# EAGLE design tvbgone3 (EAGLE 5.01)
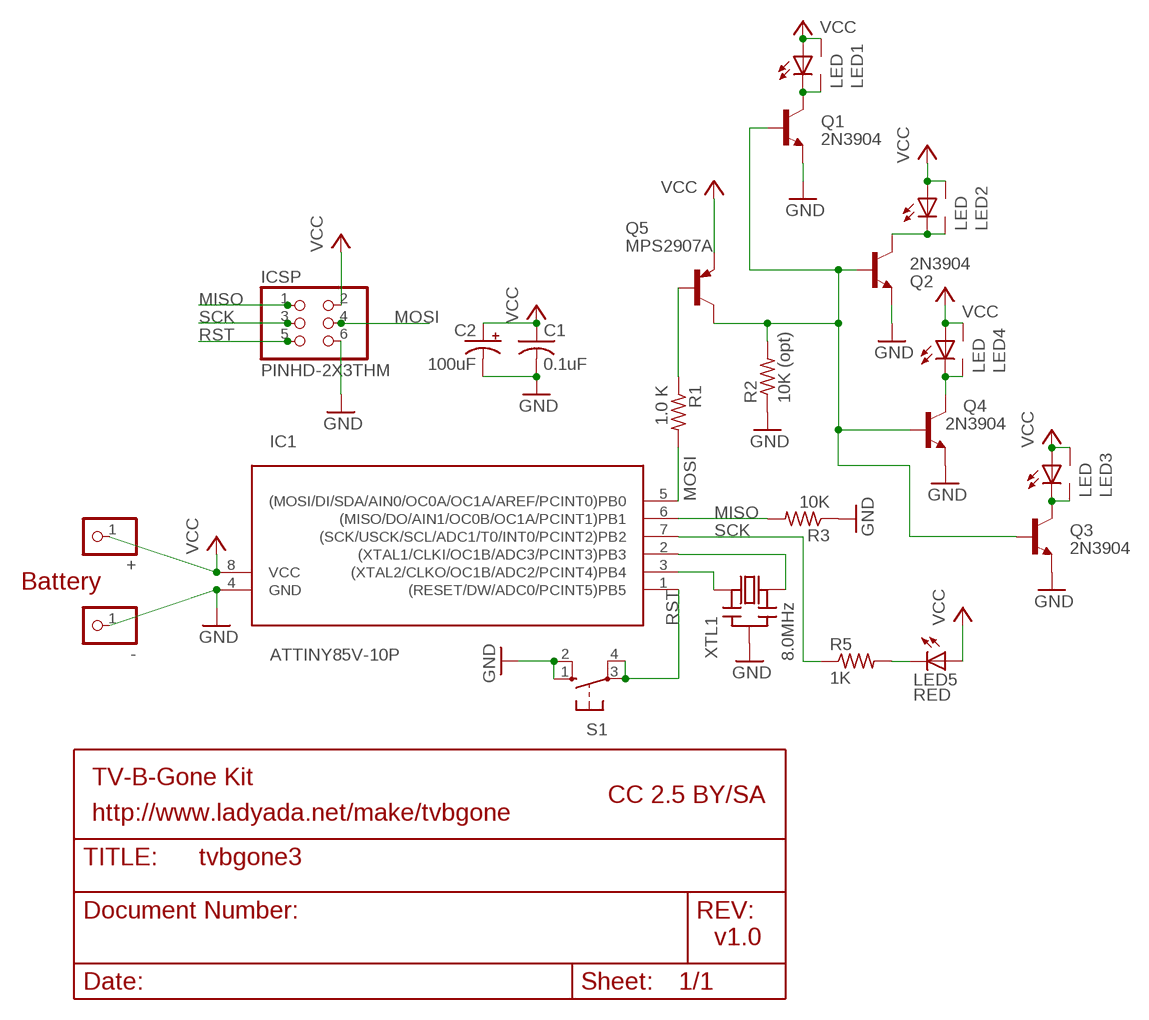
[diagram p0: schematic, sheet 1]

## Parts
+  PINHD-1X1  [1X01]
-  PINHD-1X1  [1X01]
C1  0.1uF  C-US025-025X050  [C025-025X050]
C2  100uF  CPOL-USE2.5-5  [E2,5-5]
IC1  ATTINY85V-10P  [DIL08]
ICSP  PINHD-2X3THM  [ISP6]
LED1  LED  [5MM-SIDE]
LED2  LED  [5MM-SIDE]
LED3  LED  [5MM-SIDE]
LED4  LED  [5MM-SIDE]
LED5  RED  LED3MM  [LED3MM]
Q1  2N3904  2N3904EZ  [TO92-EZ]
Q2  2N3904  2N3904EZ  [TO92-EZ]
Q3  2N3904  2N3904EZ  [TO92-EZ]
Q4  2N3904  2N3904EZ  [TO92-EZ]
Q5  MPS2907A  [TO92-CBE]
R1  1.0 K  R-US_0207/10  [0207/10]
R2  10K (opt)  R-US_0207/10  [0207/10]
R3  10K  R-US_0207/10  [0207/10]
R5  1K  R-US_0207/10  [0207/10]
S1  10-XX  [B3F-10XX]
XTL1  8.0MHz  CERMOSCILL  [CERM_OSC]

## Nets
GND: -.1 C1.2 C2.- IC1.4(GND) ICSP.6 Q1.3(E) Q2.3(E) Q3.3(E) Q4.3(E) R2.1 R3.1 S1.1(S) S1.2(S1) XTL1.P$2(GND)
MISO: IC1.6((MISO/DO/AIN1/OC0B/OC1A/PCINT1)PB1) ICSP.1 R3.2
MOSI: IC1.5((MOSI/DI/SDA/AIN0/OC0A/OC1A/AREF/PCINT0)PB0) ICSP.4 R1.2
N$1: IC1.3((XTAL2/CLKO/OC1B/ADC2/PCINT4)PB4) XTL1.P$1(IN)
N$2: IC1.2((XTAL1/CLKI/OC1B/ADC3/PCINT3)PB3) XTL1.P$3(OUT)
N$3: LED5.K(C) R5.2
N$6: Q5.B R1.1
N$7: LED4.K2(C1) LED4.K(C) Q4.1(C)
N$8: LED2.K2(C1) LED2.K(C) Q2.1(C)
N$9: LED3.K2(C1) LED3.K(C) Q3.1(C)
N$10: Q1.2(B) Q2.2(B) Q3.2(B) Q4.2(B) Q5.C R2.2
N$11: LED1.K2(C1) LED1.K(C) Q1.1(C)
RST: IC1.1((RESET/DW/ADC0/PCINT5)PB5) ICSP.5 S1.3(P) S1.4(P1)
SCK: IC1.7((SCK/USCK/SCL/ADC1/T0/INT0/PCINT2)PB2) ICSP.3 R5.1
VCC: +.1 C1.1 C2.+ IC1.8(VCC) ICSP.2 LED1.A LED1.A2(A1) LED2.A LED2.A2(A1) LED3.A LED3.A2(A1) LED4.A LED4.A2(A1) LED5.A Q5.E

## Notes on the sheet
- Battery
- TV-B-Gone Kit
- CC 2.5 BY/SA
- http://www.ladyada.net/make/tvbgone
- v1.0

## Library data of the parts
+ - = ybox2:PINHD-1X1: PIN HEADER
C1 = rcl-ez:C-US: CAPACITOR, American symbol
C2 = rcl-ez:CPOL-US: POLARIZED CAPACITOR, American symbol
IC1 = avr:ATTINY85: MICROCONTROLLER 8 Kbytes FLASH 512 bytes EEPROM 512 bytes RAM 4-channel 10 bit ADC USI
ICSP = adaprog:PINHD-2X3
LED1-LED4 = tvbgone:LED
LED5 = minimidi:LED: LED OSRAM: - CHIPLED LG R971, LG N971, LY N971, LG Q971, LY Q971, LO R971, LY R971 LH N974, LH R974 LS Q976, LO Q976, LY Q976 LO Q996 - Hyper CHIPLED LW Q18S LB Q993, LB Q99A, LB R99A - SideLED LS A670, LO A670, LY A670, LG A670, LP A670 LB A673, LV A673, LT A673, LW A673 LH A674 LY A675 LS A676, LA A676, LO A676, LY A676, LW A676 LS A679, LY A679, LG A679 - Hyper Micro SIDELED® LS Y876, LA Y876, LO Y876, LY Y876 LT Y87S - SmartLED LW L88C, LW L88S LB L89C, LB L89S, LG L890 LS L89K, LO L89K, LY L89K LS L896, LA L896, LO L896, LY L896 - TOPLED LS T670, LO T670, LY T670, LG T670, LP T670 LSG T670, LSP T670, LSY T670, LOP T670, LYG T670 LG T671, LOG T671, LSG T671 LB T673, LV T673, LT T673, LW T673 LH T674 LS T676, LA T676, LO T676, LY T676, LB T676, LH T676, LSB T676, LW T676 LB T67C, LV T67C, LT T67C, LS T67K, LO T67K, LY T67K, LW E67C LS E67B, LA E67B, LO E67B, LY E67B, LB E67C, LV E67C, LT E67C LW T67C LS T679, LY T679, LG T679 LS T770, LO T770, LY T770, LG T770, LP T770 LB T773, LV T773, LT T773, LW T773 LH T774 LS E675, LA E675, LY E675, LS T675 LS T776, LA T776, LO T776, LY T776, LB T776 LHGB T686 LT T68C, LB T68C - Hyper Mini TOPLED® LB M676 - Mini TOPLED Santana® LG M470 LS M47K, LO M47K, LY M47K Source: http://www.osram.convergy.de/
Q1-Q4 = transistor-npn:2N3904: NPN Transistor
Q5 = transistor-pnp:MPS2907*: PNP Transistror
R1-R3 R5 = rcl-ez:R-US_: RESISTOR, American symbol
S1 = switch-omron:10-XX: OMRON SWITCH
XTL1 = digg:CERMOSCILL

## Board
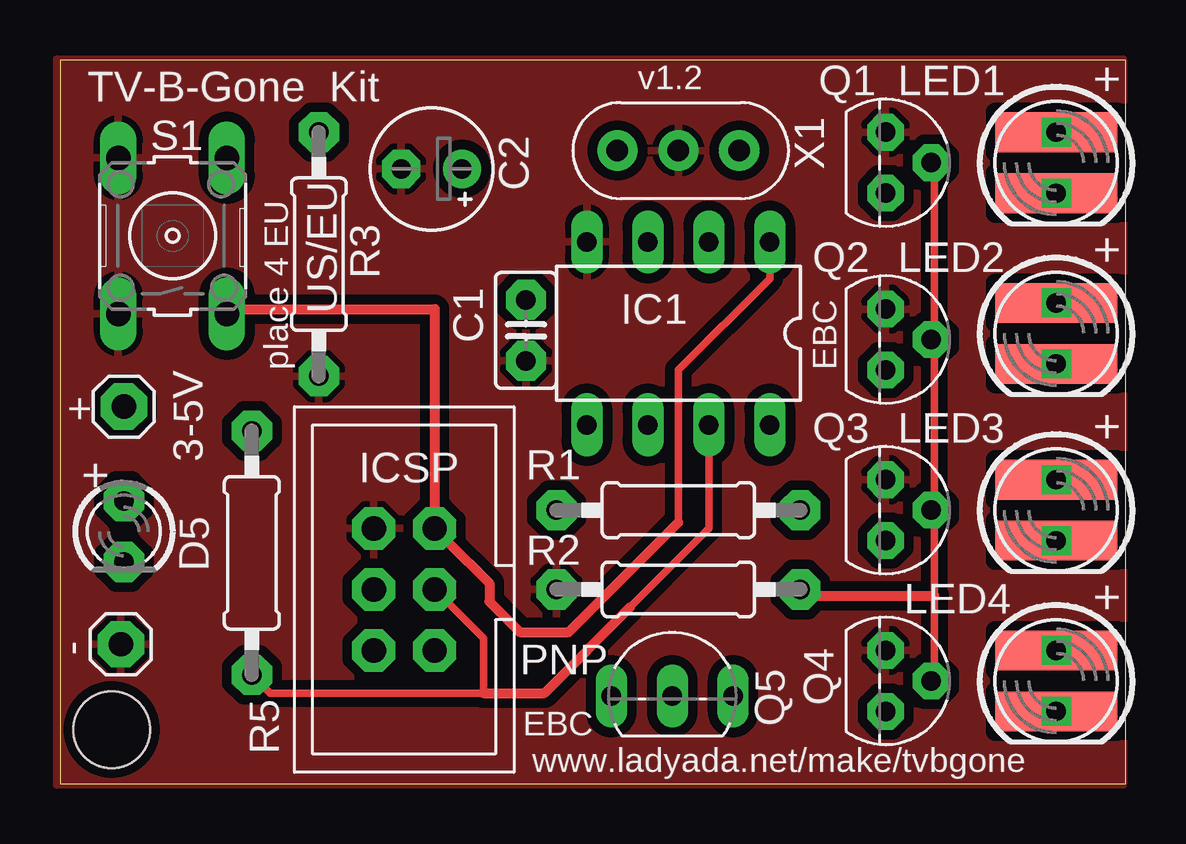
[diagram p1: board, top side]
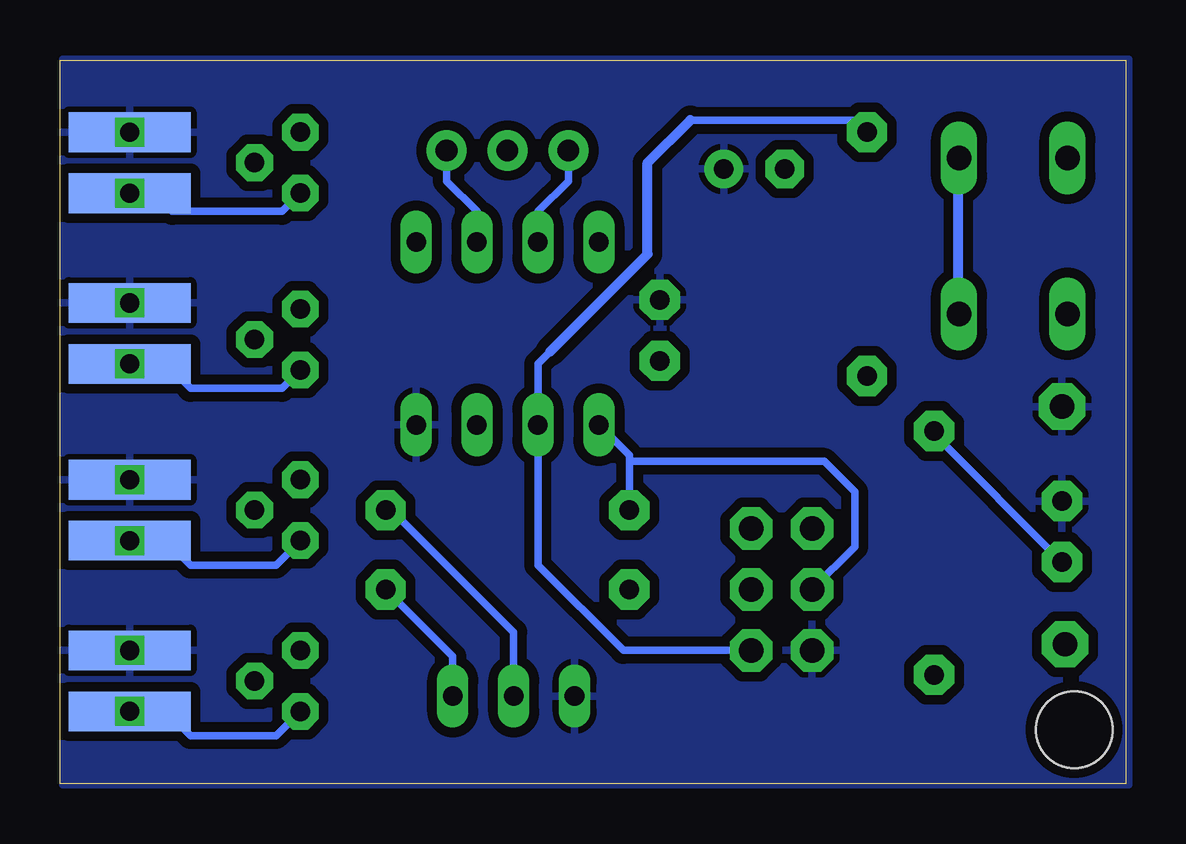
[diagram p2: board, bottom side, seen from below]

Size 44.43 x 30.15 mm. Coordinates in mm from the lower left corner, seen from the top.
Outline: 0,0 44.43,0 44.43,30.15 0,30.15 0,0
Copper layers (1*16): Top 0.035mm / dielectric 1.5mm / Bottom 0.035mm
Design rules "default": minimum track width 10mil, minimum drill 20mil, track to track 12mil, track to pad 12mil, pad to pad 12mil, via to via 12mil, smd to smd 0mil, copper to edge 0mil, drill to drill 8mil, minimum pad ring 10mil, minimum via ring 8mil, stop-mask expansion 4mil, vias tented up to drill 0mil, thermal gap 10mil
Holes 3.2 mm at 2.15,2.25

### Footprints (pad centres in the part's own frame; a part is rotated, then mirrored left to right if it is on the bottom)
1X01 = drill 1.016 pad 1.93 octagon: 1 0,0
C025-025X050 = drill 0.813 pad 1.676 octagon: 1 -1.27,0; 2 1.27,0
E2,5-5 = drill 0.813 pad 1.6 round: + -1.27,0 | drill 0.813 pad 1.6 octagon: - 1.27,0
DIL08 = drill 0.813 long: 1 -3.81,-3.81; 2 -1.27,-3.81; 3 1.27,-3.81; 4 3.81,-3.81; 5 3.81,3.81; 6 1.27,3.81; 7 -1.27,3.81; 8 -3.81,3.81
ISP6 = drill 1.016 pad 1.778 octagon: 1 -2.54,-1.27; 2 -2.54,1.27; 3 0,-1.27; 4 0,1.27; 5 2.54,-1.27; 6 2.54,1.27
5MM-SIDE = smd 1.651 x 5.08: A -1.27,0; K 1.27,0 | smd 1.651 x 5.08 bottom: A2 -1.27,0; K2 1.27,0
LED3MM = drill 0.813 pad 1.676 octagon: A -1.27,0; K 1.27,0
TO92-EZ = drill 0.813 pad 1.524 octagon: 1 1.27,0; 2 0,1.905; 3 -1.27,0
TO92-CBE = drill 0.813 long: B 0,0; C 2.54,0; E -2.54,0
0207/10 = drill 0.813 pad 1.676 octagon: 1 -5.08,0; 2 5.08,0
B3F-10XX = drill 1.016 long: 1 -3.251,2.261; 2 3.251,2.261; 3 -3.251,-2.261; 4 3.251,-2.261
CERM_OSC = drill 0.9 pad 1.676 round: P$1 -2.54,0; P$2 0,0; P$3 2.54,0

### Placement (x,y rotation side)
+  2.66,15.71 0 top
-  2.53,5.8 0 top
C1  19.43,18.88 270 top
C2  15.49,25.62 180 top
IC1  25.78,18.76 180 top
ICSP  14.35,8.09 90 top
LED1  41.52,25.87 270 top
LED2  41.52,18.76 270 top
LED3  41.52,11.39 270 top
LED4  41.52,4.28 270 top
LED5  2.66,10.5 270 top
Q1  34.41,25.87 270 top
Q2  34.41,18.5 270 top
Q3  34.41,11.39 270 top
Q4  34.41,4.28 270 top
Q5  25.52,3.65 0 top
R1  25.78,11.39 180 top
R2  25.78,8.09 0 top
R3  10.79,22.06 90 top
R5  8,9.61 90 top
S1  4.69,22.82 90 top
XTL1  25.78,26.38 0 top

### Tracks (layer width: path | path; a pad name or v marks a point on that pad's centre or on a via)
GND
  pour Top (isolate 0.406): -0.13,30.19 -0.13,-0.04 44.32,-0.04 44.32,30.19
MISO
  Bottom 0.305: ICSP.1 20.95,5.55 24.51,9.11 IC1.6 24.51,17.49 24,18 | R3.2 11.3,27.65 18.16,27.65
  Bottom 0.406: 24,18 19.93,22.06 19.93,25.87 18.16,27.65
MOSI
  Bottom 0.305: 20.7,13.42 R1.2 | 20.7,13.42 20.7,13.68 IC1.5 | ICSP.4 11.3,9.87 11.3,12.15 12.57,13.42 20.7,13.42
N$1
  Bottom 0.305: XTL1.P$1 23.24,25.11 24.51,23.84 IC1.3
N$2
  Bottom 0.305: IC1.2 27.05,23.84 28.32,25.11 XTL1.P$3
N$3
  Bottom 0.305: 8,14.95 R5.2 8,14.57 LED5.K
N$6
  Bottom 0.305: R1.1 30.6,11.39 25.52,6.31 Q5.B
N$7  (via drill 0.8)
  Bottom 0.305: Q4.1 35.43,1.99 38.98,1.99 40,3.01 LED4.K2
  other vias: 41.52,3.01
N$8  (via drill 0.8)
  Bottom 0.305: Q2.1 35.17,16.47 38.98,16.47 40,17.49 LED2.K2 41.78,17.49
  other vias: 41.52,17.49
N$9  (via drill 0.8)
  Bottom 0.305: Q3.1 35.43,9.11 38.98,9.11 40,10.12 LED3.K2 41.78,10.12
  other vias: 41.52,10.12
N$10
  Top 0.305: Q4.2 36.44,4.41 36.44,7.84 | 36.44,7.84 36.44,11.27 Q3.2 36.44,11.52 36.44,18.5 Q2.2 36.44,18.63 36.44,25.87 Q1.2 | 36.44,7.84 36.44,8.09
  Top 0.406: R2.2 30.86,7.84 36.44,7.84
  Bottom 0.305: Q5.C 28.06,5.3 R2.2
N$11  (via drill 0.8)
  Bottom 0.305: Q1.1 35.17,23.84 39.75,23.84 40.51,24.6 LED1.K2
  other vias: 41.52,24.6
RST
  Top 0.305: 16.12,10.12 16.38,9.87 | 25.78,10.88 25.78,17.23 29.59,21.04 IC1.1 29.59,22.82 | 15.62,11.39 ICSP.5 | S1.3 6.96,19.54 6.98,19.52 7.49,20.03
  Top 0.406: 25.78,10.88 21.2,6.31 19.17,6.31 17.9,7.58 17.9,8.34 16.12,10.12 ICSP.5 | 6.96,19.77 6.73,19.77 | S1.3 6.96,19.77 | 15.62,11.39 15.62,19.77 6.96,19.77
  Bottom 0.305: 6.98,26.05 S1.4 | S1.3 6.98,19.6
  Bottom 0.406: 6.98,19.6 6.98,26.05
SCK
  Top 0.305: ICSP.3 17.65,6.06 17.65,3.77 8.76,3.77 R5.1 | 27.05,15.2 IC1.7 27.05,10.63 23.74,7.33
  Top 0.406: 23.74,7.33 20.19,3.77 17.65,3.77
VCC  (via drill 0.8)
  Top 0.305: LED4.A2 41.52,5.8 41.78,5.55 LED4.A2
  Bottom 0.305: LED3.A2 41.27,12.66
  other vias: 41.52,27.14 41.52,20.03 41.52,12.66 41.52,5.55
  pour Bottom (isolate 0.406): -0.13,30.19 -0.13,-0.04 44.32,-0.04 44.32,30.19

### Text on the board
tPlace: v1.2 | Q1 | LED1 | + | TV-B-Gone Kit | S1 | X1 | C2 | US/EU | + | Q2 | LED2 | IC1 | C1 | place 4 EU | EBC | Q3 | LED3 | + | 3-5V | + | D5 | LED4 | + | PNP | EBC | Q4 | R5 | www.ladyada.net/make/tvbgone
tDocu: TM